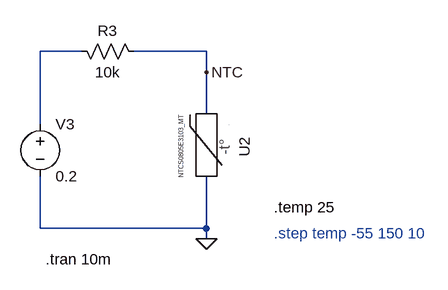
[diagram p0: schematic _NTC_Vishay1.asc]
_NTC_Vishay1.asc, the LTspice schematic file:
Version 4.1
SHEET 1 1848 836
WIRE -592 64 -656 64
WIRE -400 64 -512 64
WIRE -400 96 -400 64
WIRE -400 160 -400 96
WIRE -656 176 -656 64
WIRE -656 336 -656 256
WIRE -400 336 -400 256
WIRE -400 336 -656 336
WIRE -400 352 -400 336
FLAG -400 352 0
FLAG -400 96 NTC
SYMBOL res -496 80 M270
WINDOW 0 32 56 VTop 2
WINDOW 3 0 56 VBottom 2
SYMATTR InstName R3
SYMATTR Value 10k
SYMBOL voltage -656 160 R0
WINDOW 123 0 0 Left 2
WINDOW 39 0 0 Left 2
SYMATTR InstName V3
SYMATTR Value 0.2
SYMBOL MyLib\\Sensor_Thermistor_NTC\\_NTC_Vishay1 -400 208 R90
SYMATTR InstName U2
TEXT -648 384 Left 2 !.tran 10m
TEXT -296 304 Left 2 !.temp 25
TEXT -296 344 Left 2 ;.step temp -55 150 10

The netlist it stands for:
* _NTC_Vishay1.asc
R3 NTC N001 10k
V3 N001 0 0.2
X§U2 NTC 0 NTCS0805E3103_MT TR=0 TB=0  ; pins RN Rp
.tran 10m
.temp 25
* .step temp -55 150 10
.lib MyLib/Sensor_Thermistor_NTC/_NTC_Vishay1.lib
.backanno
.end